# EasyEDA Pro project pdd_2026-03-22.epro

# Schematic Schematic1
Board Name: Board1; Create Date: 2026-02-10; Page Name: P1; Project Name: pddunmod; Schematic Name: Schematic1; Update Date: 2026-02-10; Company: EasyEDA.com; Page Size: A4; Version: V1.0
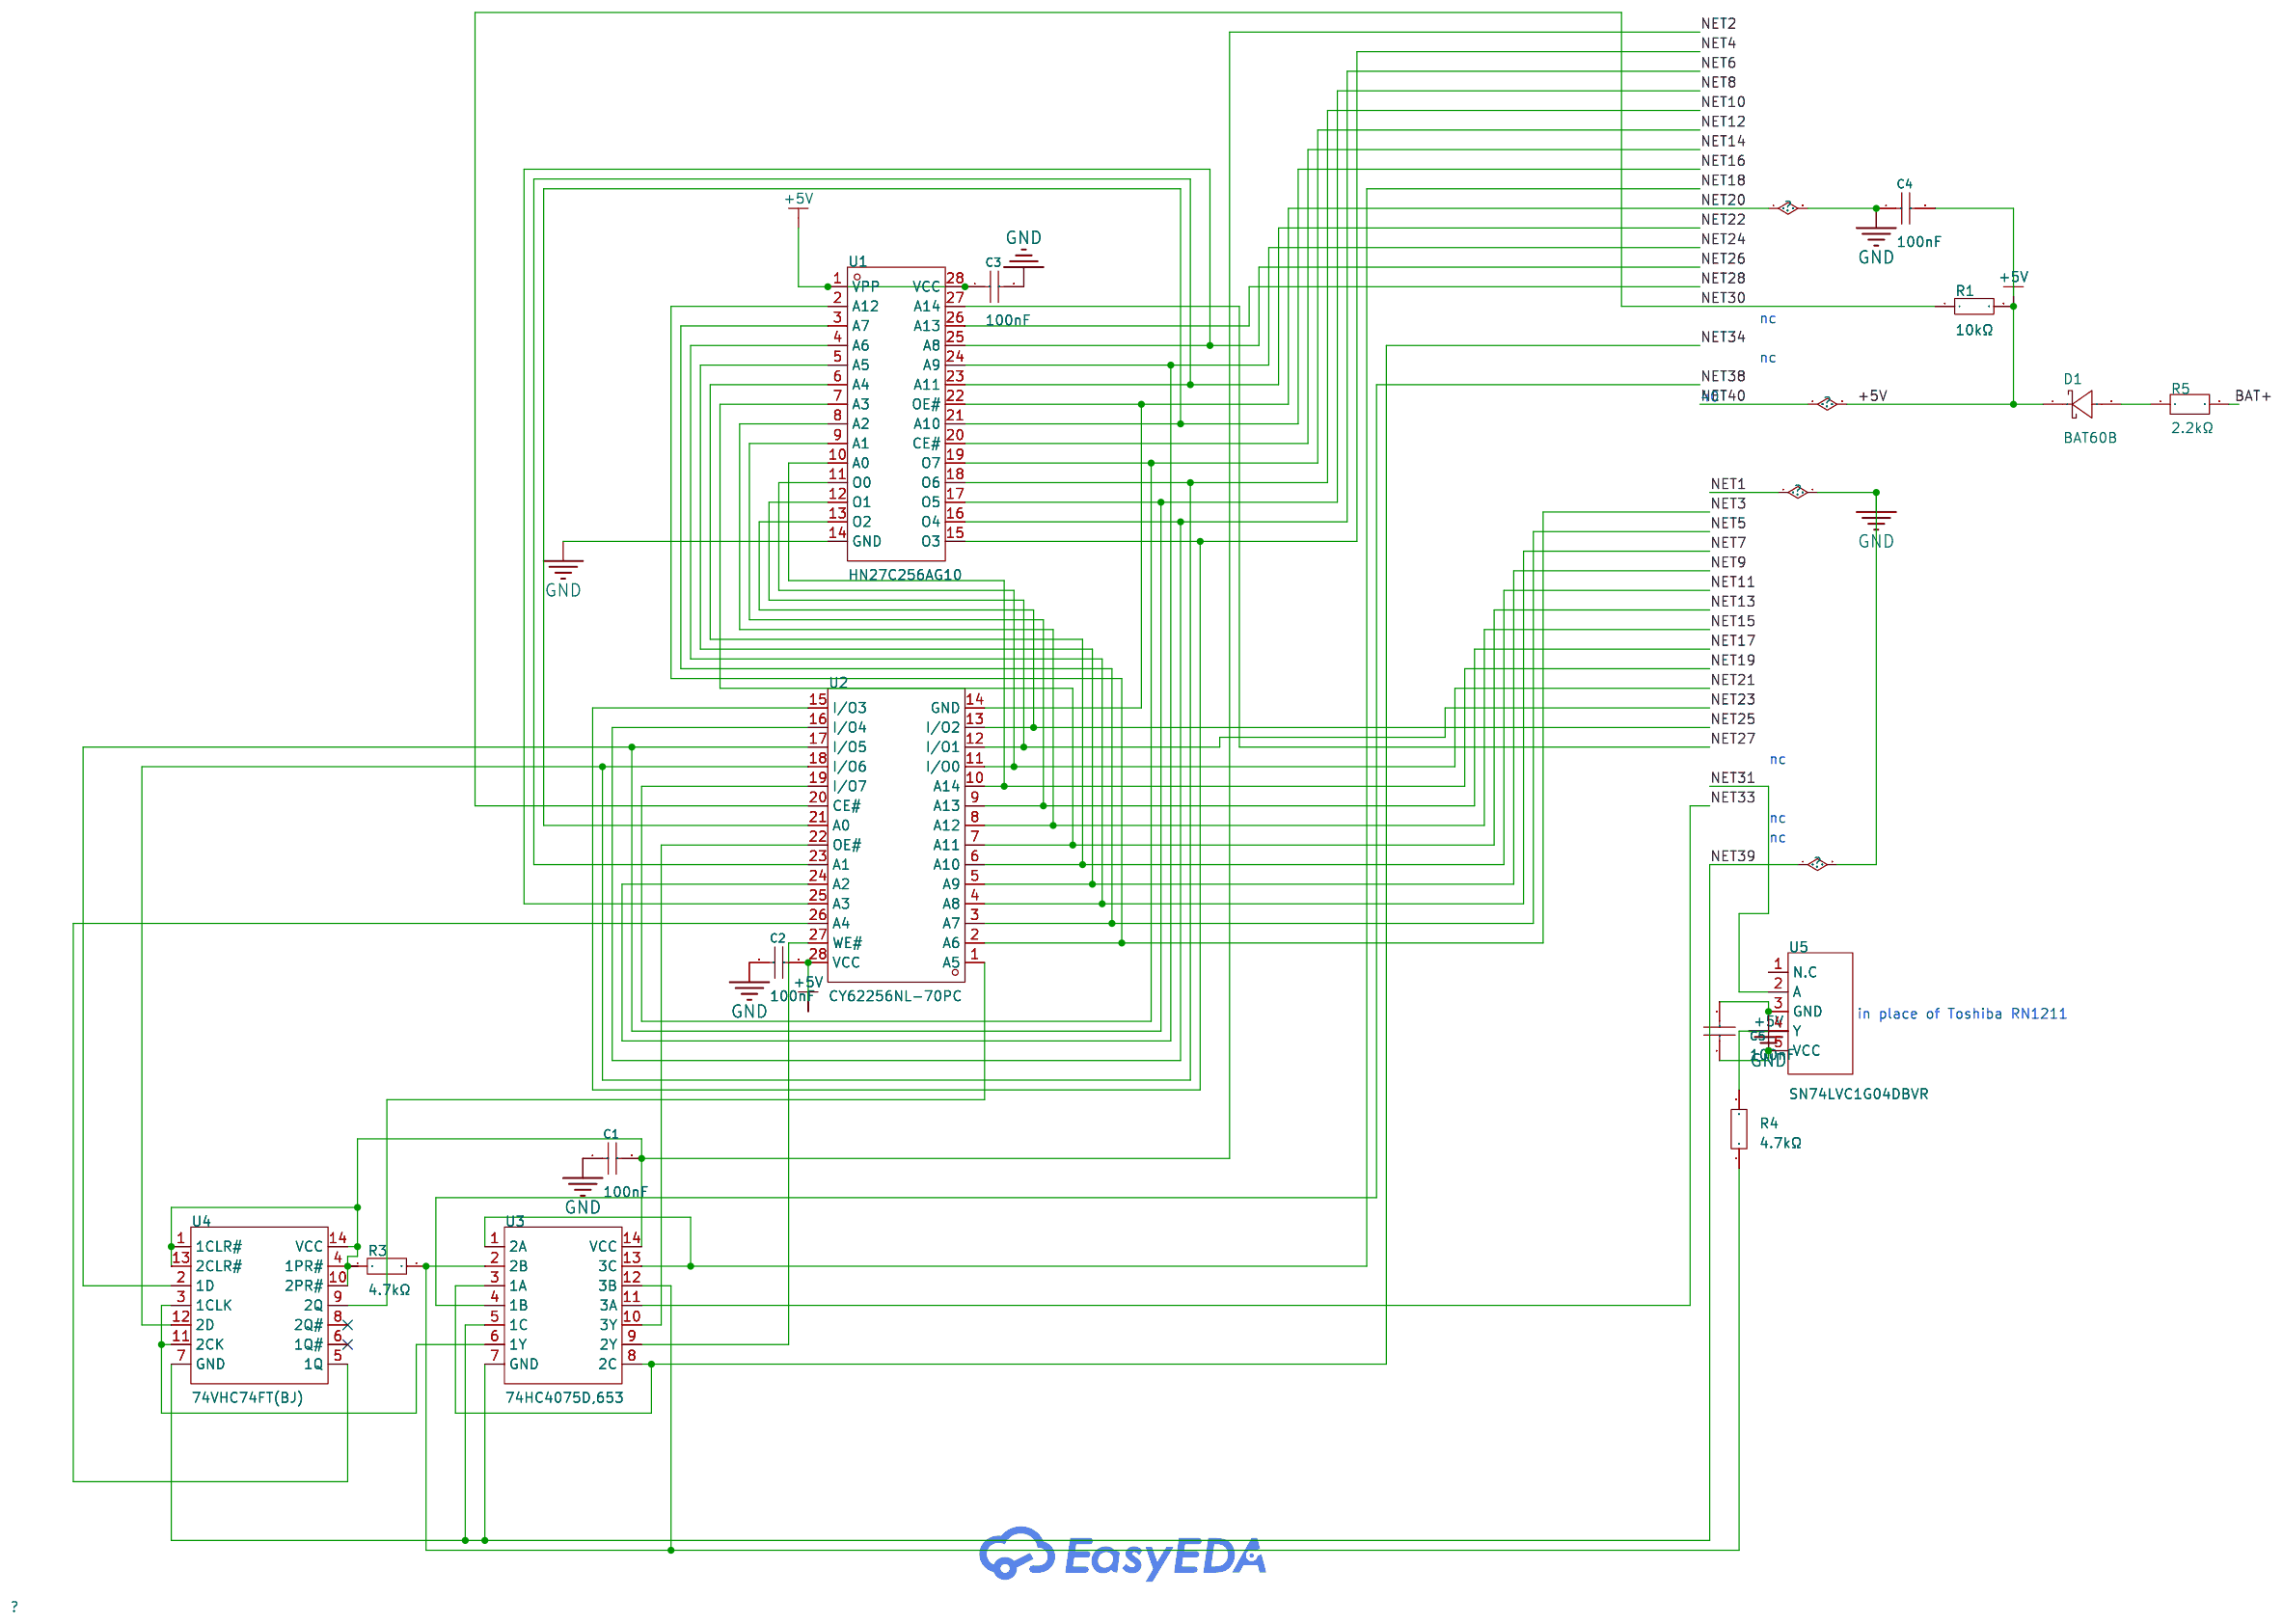
[diagram p0: schematic sheet]

## Parts
C1  100nF  [C0603]
C2  100nF  [C0603]
C3  100nF  [C0603]
C4  100nF  [C0603]
C5  100nF  [C0603]
D1  BAT60B  [SOD-323_L1.7-W1.3-LS2.6-RD-1]
R1  10kΩ  [R0805]
R3  4.7kΩ  [R0805]
R4  4.7kΩ  [R0805]
R5  2.2kΩ  [R0603]
U1  HN27C256AG10  [DIP-28_L36.8-W13.7-P2.54-LS15.6-BL]
U2  CY62256NL-70PC  [CDIP-28_L37.8-W15.4-P2.54-LS15.2-BL]
U3  74HC4075D,653  [SO-14_L8.9-W3.9-P1.27-LS6.0-BL]
U4  74VHC74FT(BJ)  [TSSOP-14_L5.0-W4.4-P0.65-LS6.5-BL]
U5  SN74LVC1G04DBVR  [SOT-23-5_L3.0-W1.7-P0.95-LS2.8-BR]

## Library data of the parts
C1-C5 = CL10B104JB8NNNC: Capacitance:100nF Tolerance:±5% Tolerance:±5% Voltage Rating:50V Temperature Coefficient:X7R; LCSC Part Name: 100nF ±5% 50V; Supplier Part: C24452; Manufacturer: SAMSUNG(三星); Supplier Footprint: 0603; JLCPCB Part Class: Extended Part; Datasheet: https://item.szlcsc.com/datasheet/CL10B104JB8NNNC/25192.html; Supplier: LCSC; Tolerance: ±5%; Voltage Rating: 50V; Temperature Coefficient: X7R
D1 = BAT60B_C7502695: Diode Configuration:Independent Voltage - Forward(Vf@If):600mV@1A Voltage - DC Reverse(Vr):10V Current - Rectified:3A Reverse Leakage Current (Ir):25uA Non-Repetitive Peak Forward Surge Current:5A; LCSC Part Name: 电压:10V 电流:3A; Supplier Part: C7502695; Manufacturer: R+O(宏嘉诚); Supplier Footprint: SOD-323; JLCPCB Part Class: Extended Part; Datasheet: https://item.szlcsc.com/datasheet/BAT60B/8589412.html; Supplier: LCSC; Diode Configuration: Independent; Voltage - Forward(Vf@If): 600mV@1A; Voltage - DC Reverse(Vr): 10V; Current - Rectified: 3A; Reverse Leakage Current (Ir): 25uA; Non-Repetitive Peak Forward Surge Current: 5A
R1 = RT0805BRD0710KL: Type:Thin Film Resistor Resistance:10kΩ Tolerance:±0.1% Tolerance:±0.1% Power(Watts):125mW Voltage-Supply(Max):150V Temperature Coefficient:±25ppm/℃ Temperature Coefficient:±25ppm/℃ Operating Temperature:-55℃~+155℃ Operating Temperature:-55℃~+155℃; LCSC Part Name: 薄膜电阻 10kΩ ±0.1% 125mW; Supplier Part: C110775; Manufacturer: YAGEO(国巨); Supplier Footprint: 0805; JLCPCB Part Class: Extended Part; Datasheet: https://item.szlcsc.com/datasheet/RT0805BRD0710KL/112000.html; Supplier: LCSC; Type: Thin Film Resistor; Tolerance: ±0.1%; Power(Watts): 125mW; Voltage-Supply(Max): 150V; Temperature Coefficient: ±25ppm/℃; Operating Temperature: -55℃~+155℃
R3 R4 = 0805W8F4701T5E: Type:Thick Film Resistors Resistance:4.7kΩ Tolerance:±1% Tolerance:±1% Power(Watts): Overload Voltage (Max): Temperature Coefficient:±100ppm/℃ Temperature Coefficient:±100ppm/℃ Operating Temperature Range:-55℃~+155℃ Operating Temperature Range:-55℃~+155℃; LCSC Part Name: 4.7kΩ ±1% 125mW 厚膜电阻; Supplier Part: C17673; Manufacturer: UNI-ROYAL(厚声); Supplier Footprint: 0805; JLCPCB Part Class: Basic Part; Datasheet: https://atta.szlcsc.com/upload/public/pdf/source/20200306/C422600_1E6D84923E4A46A82E41ADD87F860B5C.pdf; Supplier: LCSC; Type: Thick Film Resistors; Tolerance: ±1%; Temperature Coefficient: ±100ppm/℃; Operating Temperature Range: -55℃~+155℃
R5 = FRC0603F2201TS: Type:Thick Film Resistor Resistance:2.2kΩ Tolerance:±1% Tolerance:±1% Power(Watts):100mW Voltage-Supply(Max):75V Temperature Coefficient:±100ppm/℃ Temperature Coefficient:±100ppm/℃ Operating Temperature:-55℃~+155℃ Operating Temperature:-55℃~+155℃; LCSC Part Name: 2.2kΩ ±1% 100mW 厚膜电阻; Supplier Part: C2907005; Manufacturer: FOJAN(富捷); Supplier Footprint: 0603; JLCPCB Part Class: Extended Part; Supplier: LCSC; Type: Thick Film Resistor; Tolerance: ±1%; Power(Watts): 100mW; Voltage-Supply(Max): 75V; Temperature Coefficient: ±100ppm/℃; Operating Temperature: -55℃~+155℃
U1 = HN27C256AG10: Interface Type:Parallel Port Memory Size:256Kbit Supply Voltage:4.5V~5.5V Supply Voltage:4.5V~5.5V Operating Temperature:0℃~+70℃ Operating Temperature:0℃~+70℃; Supplier Part: C17319879; Manufacturer: RENESAS(瑞萨)/IDT; Supplier Footprint: CDIP-28; JLCPCB Part Class: Extended Part; Datasheet: https://atta.szlcsc.com/upload/public/pdf/source/20241016/07812A51D87A03E2949960C6A2CB133E.pdf; Supplier: LCSC; Interface Type: Parallel Port; Memory Size: 256Kbit; Supply Voltage: 4.5V~5.5V; Operating Temperature: 0℃~+70℃
U2 = CY62256NL-70PC: Supplier Part: C2956434; Manufacturer: Infineon/CYPRESS(赛普拉斯); Supplier Footprint: DIP-28; JLCPCB Part Class: Extended Part; Datasheet: https://atta.szlcsc.com/upload/public/pdf/source/20240124/703C1CA4A8A00C865B45AFA7604B5C23.pdf; Supplier: LCSC
U3 = 74HC4075D,653: Logic Type:OR Gate Number of Channels:3 Voltage - Supply:2V~6V Voltage - Supply:2V~6V Quiescent Current:2uA Current - Output Low(IOL):5.2mA Current - Output High(IOH):5.2mA Input Logic Level - High:1.5V~4.2V Input Logic Level - High:1.5V~4.2V Input Logic; Supplier Part: C547041; Manufacturer: Nexperia(安世); Supplier Footprint: SO-14; JLCPCB Part Class: Extended Part; Datasheet: https://item.szlcsc.com/datasheet/74HC4075D%252C653/568171.html; Supplier: LCSC; Logic Type: OR Gate; Number of Channels: 3; Voltage - Supply: 2V~6V; Quiescent Current: 2uA; Current - Output Low(IOL): 5.2mA; Current - Output High(IOH): 5.2mA; Input Logic Level - High: 1.5V~4.2V; Input Logic Level - Low: 500mV~1.8V; Series: 74HCSeries; Propagation Delay: 17ns@6V,50pF; Operating Temperature: -40℃~+125℃
U4 = 74VHC74FT(BJ): Supplier Part: C7421300; Manufacturer: TOSHIBA(东芝); Supplier Footprint: TSSOP14B; JLCPCB Part Class: Extended Part; Datasheet: https://item.szlcsc.com/datasheet/74VHC74FT(BJ)/8401554.html; Supplier: LCSC
U5 = SN74LVC1G04DBVR: Supply Voltage(Single):1.65V~5.5V Supply Voltage(Single):1.65V~5.5V Supply Current (Max):10uA Number of Circuits:1 Number of Inputs:1 Sink Current:32mA Source Current:32mA High level range (VIH):1.7V~2V High level range (VIH):1.7V~2V Low level range (VIL); LCSC Part Name: 单路反向器; Supplier Part: C7827; Manufacturer: TI(德州仪器); Supplier Footprint: SOT-23-5; JLCPCB Part Class: Extended Part; Datasheet: https://www.ti.com/cn/lit/gpn/sn74lvc1g04; Supplier: LCSC; Supply Voltage(Single): 1.65V~5.5V; Supply Current (Max): 10uA; Number of Circuits: 1; Number of Inputs: 1; Sink Current: 32mA; Source Current: 32mA; High level range (VIH): 1.7V~2V; Low level range (VIL): 700mV~800mV; Max Propagation Delay: 3.7ns@5V,50pF; Series: 74LVCSeries; Operating Temperature: -40℃~+125℃

## Nets
+5V: C2.2 C3.1 C4.2 C5.1 D1.1(K) R1.2 U1.1(VPP) U1.28(VCC) U2.28(VCC) U5.5(VCC)
GND: C1.1 C2.1 C3.2 C4.1 C5.2 U1.14(GND) U1.22(OE#) U2.14(GND) U3.5(1C) U3.7(GND) U4.7(GND) U5.3(GND)
BAT+: R5.2
NET2: C1.2 R3.1 U3.14(VCC) U4.1(1CLR#) U4.4(1PR#) U4.10(2PR#) U4.13(2CLR#) U4.14(VCC)
NET3: U1.2(A12) U2.2(A6)
NET4: U1.15(O3) U2.15(I/O3)
NET5: U1.3(A7) U2.3(A7)
NET6: U1.16(O4) U2.16(I/O4)
NET7: U1.4(A6) U2.4(A8)
NET8: U1.17(O5) U2.17(I/O5) U4.2(1D)
NET9: U1.5(A5) U2.5(A9)
NET10: U1.18(O6) U2.18(I/O6) U4.12(2D)
NET11: U1.6(A4) U2.6(A10)
NET12: U1.19(O7) U2.19(I/O7)
NET13: U1.7(A3) U2.7(A11)
NET14: U1.20(CE#)
NET15: U1.8(A2) U2.8(A12)
NET16: U1.21(A10) U2.21(A0)
NET17: U1.9(A1) U2.9(A13)
NET18: U3.1(2A) U3.13(3C)
NET19: U1.10(A0) U2.10(A14)
NET21: U1.11(O0) U2.11(I/O0)
NET22: U1.23(A11) U2.23(A1)
NET23: U1.12(O1) U2.12(I/O1)
NET24: U1.24(A9) U2.24(A2)
NET25: U1.13(O2) U2.13(I/O2)
NET26: U1.25(A8) U2.25(A3)
NET27: U1.27(A14)
NET28: U1.26(A13)
NET30: R1.1 U2.20(CE#)
NET31: U5.2(A)
NET33: U3.11(3A)
NET34: U3.3(1A) U3.8(2C)
NET38: U3.4(1B)
$1N1753: U2.27(WE#) U3.9(2Y)
$1N1759: U2.26(A4) U4.5(1Q)
$1N1852: U2.1(A5) U4.9(2Q)
$1N2536: U2.22(OE#) U3.10(3Y)
$1N2667: U3.6(1Y) U4.3(1CLK) U4.11(2CK)
$1N3512: R4.2 U5.4(Y)
$1N3520: R3.2 R4.1 U3.2(2B) U3.12(3B)
Net-(D1-2): D1.2(A) R5.1

Not connected (* = marked no-connect by the designer): U4 6(1Q#)* 8(2Q#)*; U5 1(N.C)

## Notes on the sheet
- nc
- nc
- 40
- nc
- nc
- nc
- in place of Toshiba RN1211

# Board PCB1
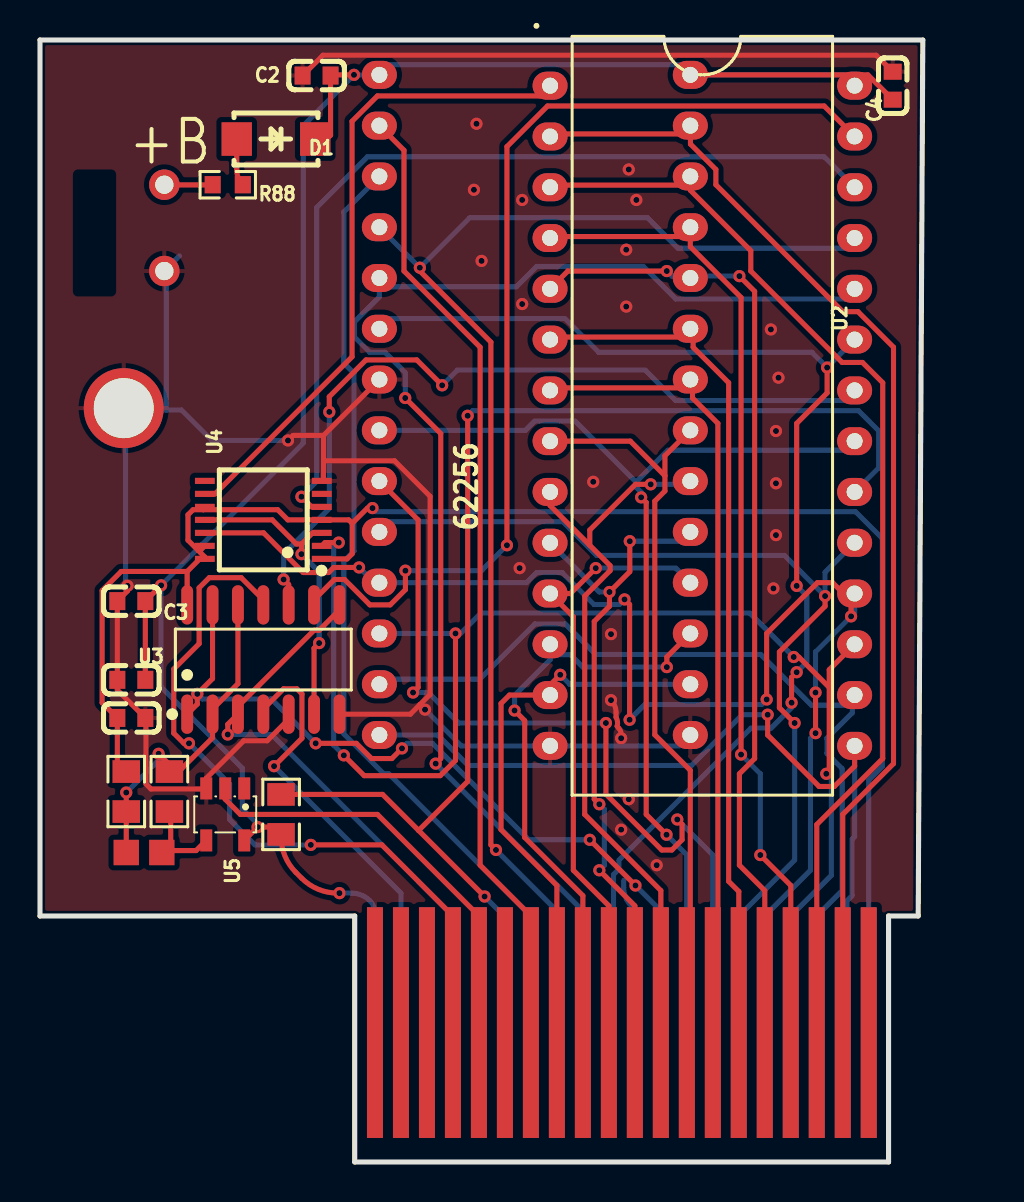
[diagram p1: board, top side]
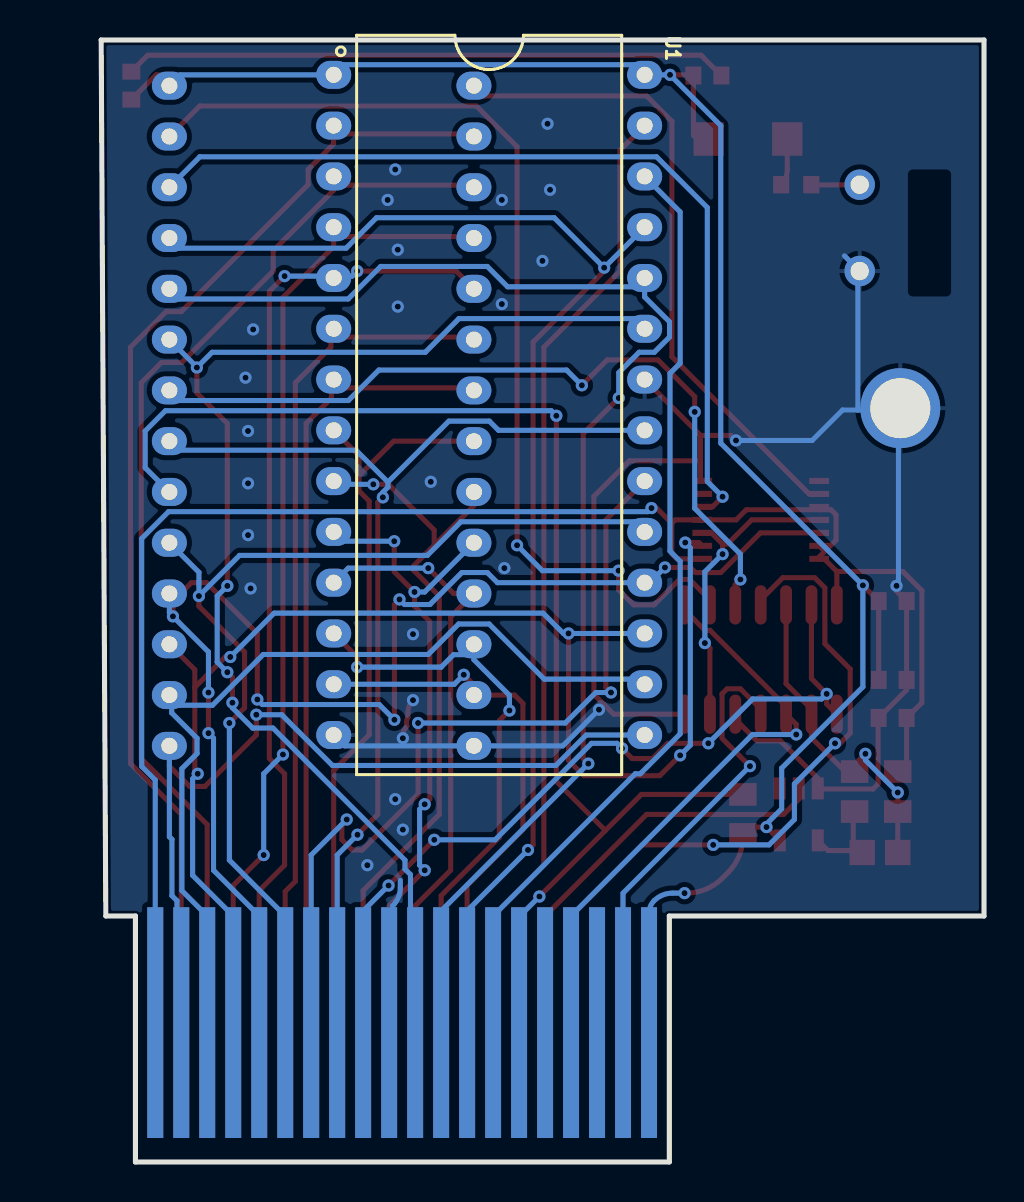
[diagram p2: board, bottom side, seen from below]

Outline 44.18 x 56.12 mm; copper layers: Top Layer, Bottom Layer. Coordinates in mm from the lower left corner of the outline.
Outline path: 0,56.12 0,12.31 15.75,12.31 15.75,0 42.47,0 42.47,12.31 43.95,12.31 44.18,56.12 0,56.12
Stack: Top Layer 0.035mm / Dielectric1 1.51mm FR4 er 4.5 / Bottom Layer 0.035mm

## Design rules (mm)
template: JLCPCB Capability(Two Layers Board)
spacing copperThickness1oz (default): track to track 0.102, other pairs 0.152 to 0.3
spacing copperThickness2oz: track to track 0.203, other pairs 0.152 to 0.3
track width copperThickness1oz (default): min 0.127, default 0.254, max 2.54
track width copperThickness2oz: min 0.203, default 0.254, max 2.54
differential pair differentialPair (default): width min 0.127, default 0.254, max 2.54; gap min 0.152, default 0.152
via viaSize (default): diameter min 0.5, default 0.61, max 10; hole min 0.3, default 0.305, max 6.3

## Placement (name value [footprint] x y rotation side)
C1  100nF  [C0603]  4.57 22.21 180 top
C2  100nF  [C0603]  13.84 54.34 0 top
C3  100nF  [C0603]  4.57 28.05 180 top
C4  100nF  [C0603]  42.67 53.83 270 top
C5  100nF  [C0603]  4.57 24.12 180 top
D1  BAT60B  [SMA_L4.2-W2.6-LS5.0-RD_1]  11.81 51.17 180 top
NOREF  -  [Pad_e11219]  28.47 6.97 0 top
NOREF#2  -  [Pad_e11215]  23.27 6.97 0 top
NOREF#3  -  [Pad_e5646]  33.67 6.97 0 top
NOREF#4  -  [Pad_e5637]  21.97 6.97 0 top
NOREF#5  -  [Pad_e11226]  37.57 6.97 0 top
NOREF#6  -  [Pad_e5647]  34.97 6.97 0 top
NOREF#7  -  [Pad_e180796]  6.1 15.48 0 top
NOREF#8  -  [Pad_e5652]  41.47 6.97 0 top
NOREF#9  -  [Pad_e5636]  20.67 6.97 0 top
NOREF#10  -  [Pad_e11228]  40.17 6.97 0 top
NOREF#11  -  [Pad_e5639]  24.57 6.97 0 top
NOREF#12  -  [Pad_e11218]  27.17 6.97 0 top
NOREF#13  -  [Pad_e5648]  36.27 6.97 0 top
NOREF#14  -  [Pad_e5649]  37.57 6.97 0 top
NOREF#15  -  [Pad_e5643]  29.77 6.97 0 top
NOREF#16  -  [Pad_e11224]  34.97 6.97 0 top
NOREF#17  -  [Pad_e11214]  21.97 6.97 0 top
NOREF#18  -  [Pad_e161798]  4.19 37.71 0 top
NOREF#19  -  [Pad_e5635]  19.37 6.97 0 top
NOREF#20  -  [Pad_e11225]  36.27 6.97 0 top
NOREF#21  -  [Pad_e11213]  20.67 6.97 0 top
NOREF#22  -  [Pad_e154531]  6.22 44.56 0 top
NOREF#23  -  [Pad_e5645]  32.37 6.97 0 top
NOREF#24  -  [Pad_e11227]  38.87 6.97 0 top
NOREF#25  -  [Pad_e5644]  31.07 6.97 0 top
NOREF#26  -  [Pad_e5594]  16.76 6.97 0 top
NOREF#27  -  [Pad_e154530]  6.22 48.88 0 top
NOREF#28  -  [Pad_e11216]  24.57 6.97 0 top
NOREF#29  -  [Pad_e5650]  38.87 6.97 0 top
NOREF#30  -  [Pad_e5642]  28.47 6.97 0 top
NOREF#31  -  [Pad_e11222]  32.37 6.97 0 top
NOREF#32  -  [Pad_e5640]  25.87 6.97 0 top
NOREF#33  -  [Pad_e11223]  33.67 6.97 0 top
NOREF#34  -  [Pad_e5638]  23.27 6.97 0 top
NOREF#35  -  [Pad_e11229]  41.47 6.97 0 top
NOREF#36  -  [Pad_e5651]  40.17 6.97 0 top
NOREF#37  -  [Pad_e180794]  4.32 15.48 0 top
NOREF#38  -  [Pad_e11217]  25.87 6.97 0 top
NOREF#39  -  [Pad_e5641]  27.17 6.97 0 top
NOREF#40  -  [Pad_e5634]  18.06 6.97 0 top
NOREF#41  -  [Pad_e11221]  31.07 6.97 0 top
NOREF#42  -  [Pad_e11220]  29.77 6.97 0 top
NOREF#43  -  [Pad_e11211]  18.06 6.97 0 top
NOREF#44  -  [Pad_e11212]  19.37 6.97 0 top
NOREF#45  -  [Pad_e11210]  16.76 6.97 0 top
R3  4.7kΩ  [R0805]  4.32 18.53 270 top
R4  4.7kΩ  [R0805]  6.48 18.53 270 top
R88  2.2kΩ  [R0603]  9.4 48.88 180 top
R99  10kΩ  [R0805]  12.06 17.39 270 top
U1  HN27C256AG10  [DIP-28_L36.8-W13.7-P2.54-LS15.6-BL]  24.76 37.87 270 bottom
U2  CY62256NL-70PC  [CDIP-28_L37.8-W15.4-P2.54-LS15.2-BL]  33.15 37.32 270 top
U3  74HC4075D,653  [SO-14_L8.9-W3.9-P1.27-LS6.0-BL]  11.18 25.13 0 top
U4  74VHC74FT(BJ)  [TSSOP-14_L5.0-W4.4-P0.65-LS6.5-BL]  11.18 32.12 90 top
U5  SN74LVC1G04DBVR  [SOT-23-5_L3.0-W1.7-P0.95-LS2.8-BR]  9.27 17.39 90 top

## Footprints (pads in the part's own frame, mm; a bottom-side part is the same pattern mirrored in y, then rotated)
C0603
  rect 0.8x0.9 smd: 1(-0.7,0) 2(0.7,0)
CDIP-28_L37.8-W15.4-P2.54-LS15.2-BL
  oval 1.4x1.75 hole 0.8: 1(-16.51,-7.62) 2(-13.97,-7.62) 3(-11.43,-7.62) 4(-8.89,-7.62) 5(-6.35,-7.62) 6(-3.81,-7.62) 7(-1.27,-7.62) 8(1.27,-7.62) 9(3.81,-7.62) 10(6.35,-7.62) 11(8.89,-7.62) 12(11.43,-7.62) 13(13.97,-7.62) 14(16.51,-7.62) 15(16.51,7.62) 16(13.97,7.62) 17(11.43,7.62) 18(8.89,7.62) 19(6.35,7.62) 20(3.81,7.62) 21(1.27,7.62) 22(-1.27,7.62) 23(-3.81,7.62) 24(-6.35,7.62) 25(-8.89,7.62) 26(-11.43,7.62) 27(-13.97,7.62) 28(-16.51,7.62)
DIP-28_L36.8-W13.7-P2.54-LS15.6-BL
  oval 1.4x1.75 hole 0.8: 1(-16.51,-7.78) 2(-13.97,-7.78) 3(-11.43,-7.78) 4(-8.89,-7.78) 5(-6.35,-7.78) 6(-3.81,-7.78) 7(-1.27,-7.78) 8(1.27,-7.78) 9(3.81,-7.78) 10(6.35,-7.78) 11(8.89,-7.78) 12(11.43,-7.78) 13(13.97,-7.78) 14(16.51,-7.78) 15(16.51,7.78) 16(13.97,7.78) 17(11.43,7.78) 18(8.89,7.78) 19(6.35,7.78) 20(3.81,7.78) 21(1.27,7.78) 22(-1.27,7.78) 23(-3.81,7.78) 24(-6.35,7.78) 25(-8.89,7.78) 26(-11.43,7.78) 27(-13.97,7.78) 28(-16.51,7.78)
Pad_e5594
  rect 0.8x11.539 smd: 39(0,0)
Pad_e5634
  rect 0.8x11.539 smd: 40(0,0)
Pad_e5635
  rect 0.8x11.539 smd: 41(0,0)
Pad_e5636
  rect 0.8x11.539 smd: 42(0,0)
Pad_e5637
  rect 0.8x11.539 smd: 43(0,0)
Pad_e5638
  rect 0.8x11.539 smd: 44(0,0)
Pad_e5639
  rect 0.8x11.539 smd: 45(0,0)
Pad_e5640
  rect 0.8x11.539 smd: 46(0,0)
Pad_e5641
  rect 0.8x11.539 smd: 47(0,0)
Pad_e5642
  rect 0.8x11.539 smd: 48(0,0)
Pad_e5643
  rect 0.8x11.539 smd: 49(0,0)
Pad_e5644
  rect 0.8x11.539 smd: 50(0,0)
Pad_e5645
  rect 0.8x11.539 smd: 51(0,0)
Pad_e5646
  rect 0.8x11.539 smd: 52(0,0)
Pad_e5647
  rect 0.8x11.539 smd: 53(0,0)
Pad_e5648
  rect 0.8x11.539 smd: 54(0,0)
Pad_e5649
  rect 0.8x11.539 smd: 55(0,0)
Pad_e5650
  rect 0.8x11.539 smd: 56(0,0)
Pad_e5651
  rect 0.8x11.539 smd: 57(0,0)
Pad_e5652
  rect 0.8x11.539 smd: 58(0,0)
Pad_e11210
  rect 0.8x11.539 smd far side: 80(0,0)
Pad_e11211
  rect 0.8x11.539 smd far side: 40(0,0)
Pad_e11212
  rect 0.8x11.539 smd far side: 41(0,0)
Pad_e11213
  rect 0.8x11.539 smd far side: 42(0,0)
Pad_e11214
  rect 0.8x11.539 smd far side: 43(0,0)
Pad_e11215
  rect 0.8x11.539 smd far side: 44(0,0)
Pad_e11216
  rect 0.8x11.539 smd far side: 45(0,0)
Pad_e11217
  rect 0.8x11.539 smd far side: 46(0,0)
Pad_e11218
  rect 0.8x11.539 smd far side: 47(0,0)
Pad_e11219
  rect 0.8x11.539 smd far side: 48(0,0)
Pad_e11220
  rect 0.8x11.539 smd far side: 49(0,0)
Pad_e11221
  rect 0.8x11.539 smd far side: 50(0,0)
Pad_e11222
  rect 0.8x11.539 smd far side: 51(0,0)
Pad_e11223
  rect 0.8x11.539 smd far side: 52(0,0)
Pad_e11224
  rect 0.8x11.539 smd far side: 53(0,0)
Pad_e11225
  rect 0.8x11.539 smd far side: 54(0,0)
Pad_e11226
  rect 0.8x11.539 smd far side: 55(0,0)
Pad_e11227
  rect 0.8x11.539 smd far side: 56(0,0)
Pad_e11228
  rect 0.8x11.539 smd far side: 57(0,0)
Pad_e11229
  rect 0.8x11.539 smd far side: 58(0,0)
Pad_e154530
  round 1.524 hole 0.914: 1(0,0)
Pad_e154531
  round 1.524 hole 0.914: 2(0,0)
Pad_e161798
  round 4 hole 3: 1(0,0)
Pad_e180794
  rect 1.27x1.27 smd: 1(0,0)
Pad_e180796
  rect 1.27x1.27 smd: 1(0,0)
R0603
  rect 0.806x0.864 smd: 1(-0.753,0) 2(0.753,0)
R0805
  rect 1.133x1.377 smd: 1(-1,0) 2(1,0)
SMA_L4.2-W2.6-LS5.0-RD_1
  rect 1.52x1.68 smd: 1(-1.965,0) 2(1.965,0)
SO-14_L8.9-W3.9-P1.27-LS6.0-BL
  oval 0.595x1.968 smd: 1(-3.81,-2.734) 2(-2.54,-2.734) 3(-1.27,-2.734) 4(0,-2.734) 5(1.27,-2.734) 6(2.54,-2.734) 7(3.81,-2.734) 8(3.81,2.734) 9(2.54,2.734) 10(1.27,2.734) 11(0,2.734) 12(-1.27,2.734) 13(-2.54,2.734) 14(-3.81,2.734)
SOT-23-5_L3.0-W1.7-P0.95-LS2.8-BR
  rect 1.1x0.6 smd: 1(1.3,-0.95) 2(1.3,0) 3(1.3,0.95) 4(-1.3,0.95) 5(-1.3,-0.95)
TSSOP-14_L5.0-W4.4-P0.65-LS6.5-BL
  rect 0.305x0.991 smd: 1(-1.95,-2.925) 2(-1.3,-2.925) 3(-0.65,-2.925) 4(0,-2.925) 5(0.65,-2.925) 6(1.3,-2.925) 7(1.95,-2.925) 8(1.95,2.925) 9(1.3,2.925) 10(0.65,2.925) 11(0,2.925) 12(-0.65,2.925) 13(-1.3,2.925) 14(-1.95,2.925)

## Nets
+5V: C2.2 C3.1 C4.2 C5.1 D1.1 NOREF#45.80 R99.2 U1.1 U1.28 U2.28 U5.5
GND: C1.1 C2.1 C3.2 C4.1 C5.2 NOREF#8.58 NOREF#18.1 NOREF#22.2 NOREF#26.39 NOREF#42.49 U1.14 U1.22 U2.14 U3.5 U3.7 U4.7 U5.3
BAT+: NOREF#27.1 R88.2
NET2: C1.2 NOREF#35.58 R3.1 U3.14 U4.1 U4.4 U4.10 U4.13 U4.14
NET3: NOREF#36.57 U1.2 U2.2
NET4: NOREF#10.57 U1.15 U2.15
NET5: NOREF#29.56 U1.3 U2.3
NET6: NOREF#24.56 U1.16 U2.16
NET7: NOREF#14.55 U1.4 U2.4
NET8: NOREF#5.55 U1.17 U2.17 U4.2
NET9: NOREF#13.54 U1.5 U2.5
NET10: NOREF#20.54 U1.18 U2.18 U4.12
NET11: NOREF#6.53 U1.6 U2.6
NET12: NOREF#16.53 U1.19 U2.19
NET13: NOREF#3.52 U1.7 U2.7
NET14: NOREF#33.52 U1.20
NET15: NOREF#23.51 U1.8 U2.8
NET16: NOREF#31.51 U1.21 U2.21
NET17: NOREF#25.50 U1.9 U2.9
NET18: NOREF#41.50 U3.1 U3.13
NET19: NOREF#15.49 U1.10 U2.10
NET21: NOREF#30.48 U1.11 U2.11
NET22: NOREF.48 U1.23 U2.23
NET23: NOREF#39.47 U1.12 U2.12
NET24: NOREF#12.47 U1.24 U2.24
NET25: NOREF#32.46 U1.13 U2.13
NET26: NOREF#38.46 U1.25 U2.25
NET27: NOREF#11.45 U1.27
NET28: NOREF#28.45 U1.26
NET29: NOREF#34.44
NET30: NOREF#2.44 R99.1 U2.20
NET31: NOREF#4.43 U5.2
NET32: NOREF#17.43
NET33: NOREF#9.42 U3.11
NET34: NOREF#21.42 U3.3 U3.8
NET35: NOREF#19.41
NET36: NOREF#44.41
NET37: NOREF#40.40
NET38: NOREF#43.40 U3.4
$1N1753: U2.27 U3.9
$1N1759: U2.26 U4.5
$1N1852: U2.1 U4.9
$1N2536: U2.22 U3.10
$1N2667: U3.6 U4.3 U4.11
$1N3512: NOREF#7.1 R4.2 U5.4
$1N3520: NOREF#37.1 R3.2 R4.1 U3.2 U3.12
$1N4661: D1.2 R88.1

Pads without a net: U4 6 8; U5 1

## Via types
v1: diameter 0.61, hole 0.305, Top Layer to Bottom Layer, 93 vias

## Routing (per net, layer and track width the routed paths; a pad name or vN(x,y) marks a point on that pad's centre or on a via; arc(x,y) is an arc through that point)
+5V: length 104.3
  Top Layer w0.254: U1.1 41.43,54.38 C4.2 ; U5.5 v1(10.89,16.75) 11.7,16.75 R99.2 12.06,16.28 arc(12.26,15.31) 12.81,14.48 13.1,14.19 arc(13.92,13.64) 14.9,13.45 v1(14.99,13.45) ; v1(6.06,28.84) C3.1 C5.1 ; 14.24,51.06 14.54,51.36 14.54,54.34 14.58,54.38 v1(15.71,54.38)
  Bottom Layer w0.254: NOREF#45.80 16.76,12.45 arc(16.7,12.79) 16.51,13.07 arc(16.09,13.35) 15.59,13.45 v1(14.99,13.45) ; U2.28 40.22,54.38 U1.1 32.04,54.88 17.49,54.88 U1.28 v1(15.71,54.38) 13.17,51.84 13.17,35.96 v1(6.06,28.84) 6.06,23.76 10.13,19.7 10.13,17.67 10.89,16.91 v1(10.89,16.75)
GND: length 129
  Top Layer w0.254: 19.02,22.88 19.52,23.39 19.52,33.29 17.75,35.07 14.19,35.07 ; 19.02,22.88 v1(19.27,22.63) ; 19.02,22.88 18.53,22.4 U3.7 ; U4.7 14.19,34.16 14.19,35.07 ; 14.19,35.07 14.19,36.34 ; C2.1 14.16,55.36 41.85,55.36 C4.1 ; v1(12.41,36.09) 12.67,36.34 14.19,36.34 ; v1(29.08,21.2) 29.08,21.4 arc(29.05,21.56) 28.96,21.7 arc(28.92,21.75) 28.88,21.8 arc(28.9,22.03) 28.83,22.25 28.83,22.49 arc(28.76,22.82) v1(28.57,23.1) ; 14.19,36.34 16.98,39.14 ; U3.5 12.38,22.34 12.38,22.08 11.37,21.07 10.19,21.07 8.32,19.19 U5.3 8.29,18.66 5.56,18.66 5.3,18.91 5.3,22.18 C1.1 3.87,23.61 C5.2 C3.2 4.38,28.56 v1(4.38,28.82)
  Bottom Layer w0.254: 6.32,37.61 4.28,37.61 ; 6.32,37.61 6.32,44.47 NOREF#22.2 6.98,45.33 ; 6.32,37.61 7.08,37.61 8.6,36.09 v1(12.41,36.09) ; 4.28,37.61 4.28,28.91 v1(4.38,28.82) ; 4.28,37.61 NOREF#18.1 ; 29.21,14.08 29.21,13.73 arc(29.31,13.24) 29.59,12.81 29.59,7.4 arc(29.64,7.17) NOREF#42.49 ; 32.54,21.36 32,20.81 U2.14 21.08,20.81 v1(19.27,22.63)
  vias: v1(21.72,48.63) v1(21.84,51.93) v1(22.1,45.07) v1(24,29.7) v1(24.13,48.12) v1(24.13,42.91) v1(27.69,34.02) v1(28.57,26.4) v1(29.08,16.62) v1(29.34,45.63) v1(29.34,42.79) v1(29.46,49.64) v1(29.46,18.15) v1(29.84,48.12) v1(30.86,14.85) v1(36.58,41.64) v1(36.7,28.69) v1(36.83,36.56) v1(36.83,33.95) v1(36.83,31.36) v1(36.96,39.23)
BAT+: length 2.6
  Top Layer w0.254: 8.83,48.87 6.23,48.87 NOREF#27.1
NET2: length 83.9
  Top Layer w0.254: 7.37,29.54 4.06,29.54 3.11,28.58 3.11,22.97 C1.2 3.87,19.97 R3.1 ; 7.37,29.54 U3.14 ; 7.37,29.54 8,30.17 8.25,30.17 8.25,30.26 7.91,30.59 ; U4.1 15.37,30.17 15.62,30.42 15.62,31.95 ; 7.91,30.59 7.41,31.1 7.41,32.37 7.66,32.63 8.17,32.63 ; 7.91,30.59 8.03,30.59 8.25,30.82 ; 8.17,32.63 11.9,32.63 12.41,32.12 U4.4 15.45,32.12 15.62,31.95 ; 8.17,32.63 8.17,32.69 8.25,32.77 ; v1(16.64,32.71) 16.39,32.71 15.62,31.95
  Bottom Layer w0.254: NOREF#35.58 41.47,19.11 42.15,19.79 42.15,31.18 40.81,32.53 16.82,32.53 v1(16.64,32.71)
NET3: length 57.7
  Top Layer w0.254: 32.55,51.42 32.55,50.91 33.82,49.64 33.82,48.88 40.17,42.53 40.93,42.53 42.71,40.75 42.71,19.93 40.17,17.39 NOREF#36.57 ; 32.55,51.42 25.65,51.42 U2.2 ; 32.55,51.42 32.55,51.83 U1.2
NET4: length 43.1
  Top Layer w0.254: U2.15 40.77,19.8 39.75,18.78 38.99,18.78 36.41,21.36 v1(36.41,22.37)
  Bottom Layer w0.254: v1(36.41,22.37) 35.15,22.37 32.6,19.83 21.43,19.83 19.91,21.36 16.98,21.36 ; U2.15 40.77,16.27 40.64,16.14 40.64,13.32 40.39,13.07 40.39,7.19 NOREF#10.57
NET5: length 55.3
  Top Layer w0.254: NOREF#29.56 38.87,16.88 42.17,20.18 42.17,38.98 41.16,39.99 40.14,39.99 35.57,44.56 35.57,45.58 32.54,48.61 32.54,48.86 ; 32.54,48.86 U1.3 ; 32.54,48.86 25.63,48.86 U2.3
NET6: length 44.6
  Bottom Layer w0.254: U1.16 17.24,24.15 22,24.15 24.76,26.91 26.29,26.91 27.81,25.39 36.07,25.39 38.61,22.85 40.26,22.85 40.65,23.24 ; NOREF#24.56 38.87,12.31 40.14,13.58 40.14,19.67 39.38,20.43 39.38,21.2 40.65,22.47 40.65,23.24 ; U2.16 40.65,23.24
NET7: length 48.9
  Top Layer w0.254: 32.54,46.29 32.54,45.78 35.08,43.24 v1(35.08,20.38) ; 32.54,46.29 U1.4 ; 32.54,46.29 25.6,46.29 U2.4 ; v1(36.05,15.35) 37.57,13.83 NOREF#14.55
  Bottom Layer w0.254: v1(36.05,15.35) 36.05,19.42 v1(35.08,20.38)
NET8: length 69.5
  Top Layer w0.254: U4.2 14.27,30.98 v1(14.95,30.98) ; 39.5,23.74 39.5,19.57 v1(39.35,19.42) ; 39.5,23.74 39.5,24.62 U2.17 ; 39.5,23.74 37.97,25.26 v1(37.72,25.26) ; v1(20.79,26.44) 20.79,20.09 20.03,19.32 16.22,19.32 v1(15.21,20.34)
  Bottom Layer w0.254: 16.98,26.44 21.05,26.44 22.06,27.45 35.53,27.45 v1(37.72,25.26) ; v1(15.21,20.34) 14.7,20.85 14.7,30.73 v1(14.95,30.98) ; NOREF#5.55 37.57,12.31 39.6,14.34 39.6,19.16 v1(39.35,19.42)
NET9: length 48.6
  Top Layer w0.254: v1(35,44.31) 35.76,43.55 35.76,20.18 35,19.42 35,14.85 36.27,13.58 NOREF#13.54 ; v1(31.37,44.56) 26.42,44.56 U2.5
  Bottom Layer w0.254: 32.64,44.31 32.54,44.22 ; 32.64,44.31 v1(35,44.31) ; 32.64,44.31 31.62,44.31 v1(31.37,44.56)
NET10: length 69.7
  Top Layer w0.254: v1(38.81,21.45) v1(38.81,23.48) ; 8.25,31.47 11.19,31.47 13.17,29.48 14.44,29.48 14.7,29.74 v1(15.97,29.74) ; v1(36.36,23.13) 36.36,26.44 38.9,28.98 39.67,28.98 40.59,28.05 v1(40.59,27.29) ; v1(29.25,28.14) 29.51,27.88 v1(29.51,22.12)
  Bottom Layer w0.254: NOREF#20.54 36.27,12.31 38.56,14.59 38.56,21.2 v1(38.81,21.45) ; U2.18 40.77,27.47 38.81,25.51 v1(38.81,23.48) ; v1(29.25,28.14) 29,27.88 27.73,27.88 26.13,29.48 24.86,29.48 24.35,28.98 U1.18 16.73,28.98 v1(15.97,29.74) ; v1(29.51,22.12) 30.27,22.88 36.11,22.88 v1(36.36,23.13)
NET11: length 42.9
  Top Layer w0.254: 32.68,41.26 25.65,41.26 U2.6 ; 32.68,41.26 32.68,40.75 34.46,38.98 34.46,14.04 34.97,13.53 NOREF#6.53 ; 32.68,41.26 32.68,41.54 U1.6
NET12: length 51.1
  Top Layer w0.254: v1(37.76,21.96) 37,22.72 37,25.51 39.29,27.8 v1(39.29,28.31)
  Bottom Layer w0.254: U1.19 17.49,32.02 26.17,32.02 27.86,30.34 37.26,30.34 v1(39.29,28.31) 39.29,29.5 U2.19 ; v1(37.76,21.96) 37.76,15.1 34.97,12.31 NOREF#16.53
NET13: length 40
  Top Layer w0.254: U2.7 25.65,38.72 32.65,38.72 ; NOREF#3.52 33.92,7.23 33.92,36.94 32.65,38.21 32.65,38.72 ; 32.65,38.72 32.65,39.03 32.54,39.14
NET14: length 42.5
  Top Layer w0.254: U1.20 18.92,32.12 18.92,23.74 v1(18.67,23.48) ; v1(31.89,17.13) 32.13,16.89 32.13,16.12 31.62,15.61 31.12,15.61 28.32,18.4 v1(28.32,21.96)
  Bottom Layer w0.254: v1(31.89,17.13) 33.67,15.35 NOREF#33.52 ; v1(28.32,21.96) 20.96,21.96 19.43,23.48 v1(18.67,23.48)
NET15: length 37.6
  Top Layer w0.254: 31.27,34.32 31.27,35.33 U1.8 ; 31.27,34.32 29.54,36.05 U2.8 ; 31.27,34.32 31.27,33.56 30.77,33.05 30.77,21.37 32.54,19.59 32.54,7.15 NOREF#23.51
NET16: length 54.2
  Top Layer w0.254: v1(31.35,16.37) 30.34,17.39 30.34,32.99 v1(30.08,33.25)
  Bottom Layer w0.254: U2.21 40.32,35.6 31.43,35.6 29.83,34.01 ; 29.83,34.01 26.78,37.06 24.75,37.06 24.29,36.6 U1.21 ; 29.83,34.01 29.83,33.75 30.08,33.5 v1(30.08,33.25) ; v1(31.35,16.37) 32.37,15.35 NOREF#31.51
NET17: length 36.7
  Top Layer w0.254: v1(30.56,33.9) 29.8,33.9 27.51,31.61 27.51,30.85 ; U2.9 25.53,32.83 27.51,30.85 ; 27.51,30.85 28.53,29.83 28.53,29.58 27.26,28.31 27.26,17.39 31.07,13.58 NOREF#25.50
  Bottom Layer w0.254: v1(30.56,33.9) 32.38,33.9 U1.9
NET18: length 39.9
  Top Layer w0.254: v1(29.8,13.83) v1(27.51,16.12) ; v1(18.12,20.69) 17.61,20.18 16.59,20.18 15.83,20.94 v1(13.8,20.94) ; U3.13 8.64,24.18 v1(7.87,23.41) 7.87,22.91 U3.1
  Bottom Layer w0.254: v1(18.12,20.69) 18.37,20.94 19.64,20.94 24.47,16.12 v1(27.51,16.12) ; v1(7.87,23.41) 8.13,23.16 11.58,23.16 v1(13.8,20.94) ; v1(29.8,13.83) 31.07,12.56 NOREF#41.50
NET19: length 33.1
  Top Layer w0.254: v1(27.99,14.59) 29.77,12.81 NOREF#15.49 ; v1(27.99,17.89) 27.74,18.15 27.74,27.04 28.5,27.8 v1(28.5,28.51) 29.51,29.53 v1(29.51,31.05)
  Bottom Layer w0.254: U1.10 32.08,31.05 v1(29.51,31.05) ; v1(27.99,14.59) 28.25,14.85 28.25,17.64 v1(27.99,17.89) ; U2.10 27.99,28.51 v1(28.5,28.51)
NET21: length 30.5
  Top Layer w0.254: v1(27.81,29.7) 26.54,28.43 U2.11 26.69,27.27 26.69,14.59 28.47,12.81 NOREF#30.48
  Bottom Layer w0.254: U1.11 31.82,29.7 v1(27.81,29.7)
NET22: length 63.9
  Top Layer w0.254: v1(37.87,28.82) 37.87,36.94 39.39,38.47 v1(39.39,39.74) ; v1(37.61,22.97) 37.61,24.24 v1(37.87,24.5)
  Bottom Layer w0.254: v1(37.87,24.5) 38.37,25.01 38.37,28.31 v1(37.87,28.82) ; v1(37.61,22.97) 37.61,22.72 36.6,21.7 35.58,21.7 28.98,15.1 28.98,14.65 28.7,14.38 28.7,7.21 NOREF.48 ; U2.23 39.39,39.76 v1(39.39,39.74) 38.63,40.5 27.96,40.5 26.28,42.18 17.49,42.18 U1.23
NET23: length 29.3
  Top Layer w0.254: NOREF#39.47 27.17,13.32 24.26,16.23 24.26,22.07 v1(23.75,22.58) ; 32.54,26.44 31.37,25.26 v1(31.37,24.75)
  Bottom Layer w0.254: v1(23.75,22.58) 23.75,23.34 25.53,25.12 25.53,25.38 ; v1(31.37,24.75) 27.17,24.75 26.54,25.38 25.53,25.38 ; 25.53,25.38 U2.12
NET24: length 68.2
  Top Layer w0.254: v1(19.8,19.93) 20.06,20.18 20.06,36.44 v1(18.28,38.21)
  Bottom Layer w0.254: 16.98,43.78 23.84,43.78 24.86,44.79 30.19,44.79 31.82,43.17 40.26,43.17 U2.24 ; 16.98,43.78 16.98,43.27 15.74,42.02 15.74,41.26 16.5,40.5 17.26,40.5 18.28,39.48 v1(18.28,38.21) ; 16.98,43.78 16.98,44.22 ; v1(19.8,19.93) 27.17,12.56 NOREF#12.47
NET25: length 27.7
  Top Layer w0.254: NOREF#32.46 25.87,13.83 23.07,16.62 23.07,22.93 23.5,23.35 U2.13 25.53,23.86 v1(26.03,24.37)
  Bottom Layer w0.254: v1(26.03,24.37) 26.51,23.9 U1.13
NET26: length 67.1
  Top Layer w0.254: v1(22.82,15.61) 22.57,15.86 22.57,41.01 19.01,44.56 v1(19.01,44.73)
  Bottom Layer w0.254: U1.25 v1(19.01,44.73) 21.51,47.23 30.4,47.23 31.92,45.71 40.26,45.71 U2.25 ; NOREF#38.46 25.87,12.56 v1(22.82,15.61)
NET27: length 48
  Top Layer w0.254: U1.27 18.22,50.6 18.22,44.56 22.03,40.75 22.03,14.85 24.57,12.31 NOREF#11.45
NET28: length 47.5
  Bottom Layer w0.254: U1.26 15.21,47.52 15.21,39.95 15.71,39.45 15.71,30.56 15.21,30.05 15.21,21.41 17.2,19.42 17.46,19.42 24.57,12.31 NOREF#28.45
NET30: length 65.4
  Top Layer w0.254: v1(22.25,13.28) 18.95,16.58 ; 18.95,16.58 21.4,19.04 v1(21.4,37.32) ; 18.95,16.58 17.15,18.39 R99.1
  Bottom Layer w0.254: U2.20 41.98,34.72 41.98,36.56 40.96,37.58 21.66,37.58 v1(21.4,37.32) ; v1(22.25,13.28) 23.27,12.26 NOREF#2.44
NET31: length 21
  Top Layer w0.254: NOREF#4.43 21.97,12.31 16.89,17.39 10.03,17.39 9.27,18.15 U5.2
NET33: length 36.1
  Top Layer w0.254: v1(13.55,15.86) 17.11,15.86 20.67,12.31 NOREF#9.42 ; v1(7.46,20.94) 7.2,20.94 6.7,21.45 6.7,24.66 7.97,25.93 7.97,28.72 8.47,29.23 10.07,29.23 11.08,28.21 11.08,27.96 U3.11
  Bottom Layer w0.254: v1(13.55,15.86) 10.76,15.86 9.49,17.13 9.49,18.91 v1(7.46,20.94)
NET34: length 29.3
  Top Layer w0.254: v1(9.4,21.38) 9.4,21.89 U3.3 9.91,22.79 13.72,26.6 13.97,26.6 14.99,27.61 U3.8
  Bottom Layer w0.254: v1(9.4,21.38) 11.59,21.38 20.67,12.31 NOREF#21.42
NET38: length 22.4
  Top Layer w0.254: U3.4 11.18,22.65 12.19,23.67 12.86,23.67 13.11,23.41 13.11,21.19 v1(11.71,19.8)
  Bottom Layer w0.254: NOREF#43.40 18.06,13.45 v1(11.71,19.8)
$1N1753: length 51.5
  Top Layer w0.254: U2.27 39.24,52.82 25.4,52.82 23.37,50.79 v1(23.37,30.85) ; U3.9 13.72,28.12 14.73,29.14 15.24,29.14 16.51,27.87 17.53,27.87 18.29,28.63 v1(18.29,29.58)
  Bottom Layer w0.254: v1(18.29,29.58) 22.1,29.58 v1(23.37,30.85)
$1N1759: length 44.6
  Top Layer w0.254: v1(13.09,33.28) 13.59,32.77 U4.5
  Bottom Layer w0.254: v1(13.09,33.28) 13.85,34.04 13.85,47.74 16.39,50.28 39.24,50.28 U2.26
$1N1852: length 32.6
  Top Layer w0.254: U2.1 25.01,53.32 16.89,53.32 15.62,52.05 15.62,40.28 8.76,33.42 8.25,33.42
$1N2536: length 40.2
  Top Layer w0.254: U3.10 12.45,28.88 v1(12.19,29.14) ; v1(14.48,37.52) 14.48,38.28 16.32,40.12 18.86,40.12 v1(20.13,38.85)
  Bottom Layer w0.254: v1(14.48,37.52) 14.48,32.69 12.19,30.41 v1(12.19,29.14) ; v1(20.13,38.85) 20.89,39.61 30.29,39.61 31.81,38.09 40.26,38.09 U2.22
$1N2667: length 15.6
  Top Layer w0.254: U3.6 13.72,25.7 v1(13.97,25.95) ; v1(13.09,30.4) 13.09,30.91 ; 13.09,30.91 13.64,31.47 U4.3 ; 13.09,30.91 12.83,30.91 11.63,32.12 8.25,32.12
  Bottom Layer w0.254: v1(13.97,25.95) 13.97,29.52 v1(13.09,30.4)
$1N3512: length 4.5
  Top Layer w0.254: 6.54,15.58 6.19,15.58 NOREF#7.1 ; 6.54,15.58 7.81,15.58 U5.4 ; 6.54,15.58 6.54,17.46 R4.2
$1N3520: length 16.7
  Top Layer w0.254: NOREF#37.1 R3.2 v1(4.32,18.48) ; 6.6,19.66 7.07,19.66 8.64,21.22 U3.2 8.64,22.65 9.91,23.92 U3.12 ; 6.6,19.66 6.6,19.75 v1(5.94,20.42) ; 6.6,19.66 R4.1
  Bottom Layer w0.254: v1(4.32,18.48) 5.94,20.1 v1(5.94,20.42)
$1N4661: length 2.4
  Top Layer w0.254: D1.2 9.85,49.62 arc(9.93,49.22) R88.1

## Copper pours and planes (outline as drawn; the poured copper is in the pictures)
GND on Top Layer: -14.99,64.76 46.61,64.76 46.61,11.16 -14.99,11.16
GND on Bottom Layer: -15.88,69.07 45.34,69.07 45.34,11.16 -15.88,11.16

## Text on the board
Bottom Solder Mask Layer: ROBERT HERON | 27C256
Top Silkscreen Layer: 62256 | +B
